# EAGLE design ingress (EAGLE 5.11)

## Sheet 1 of 3
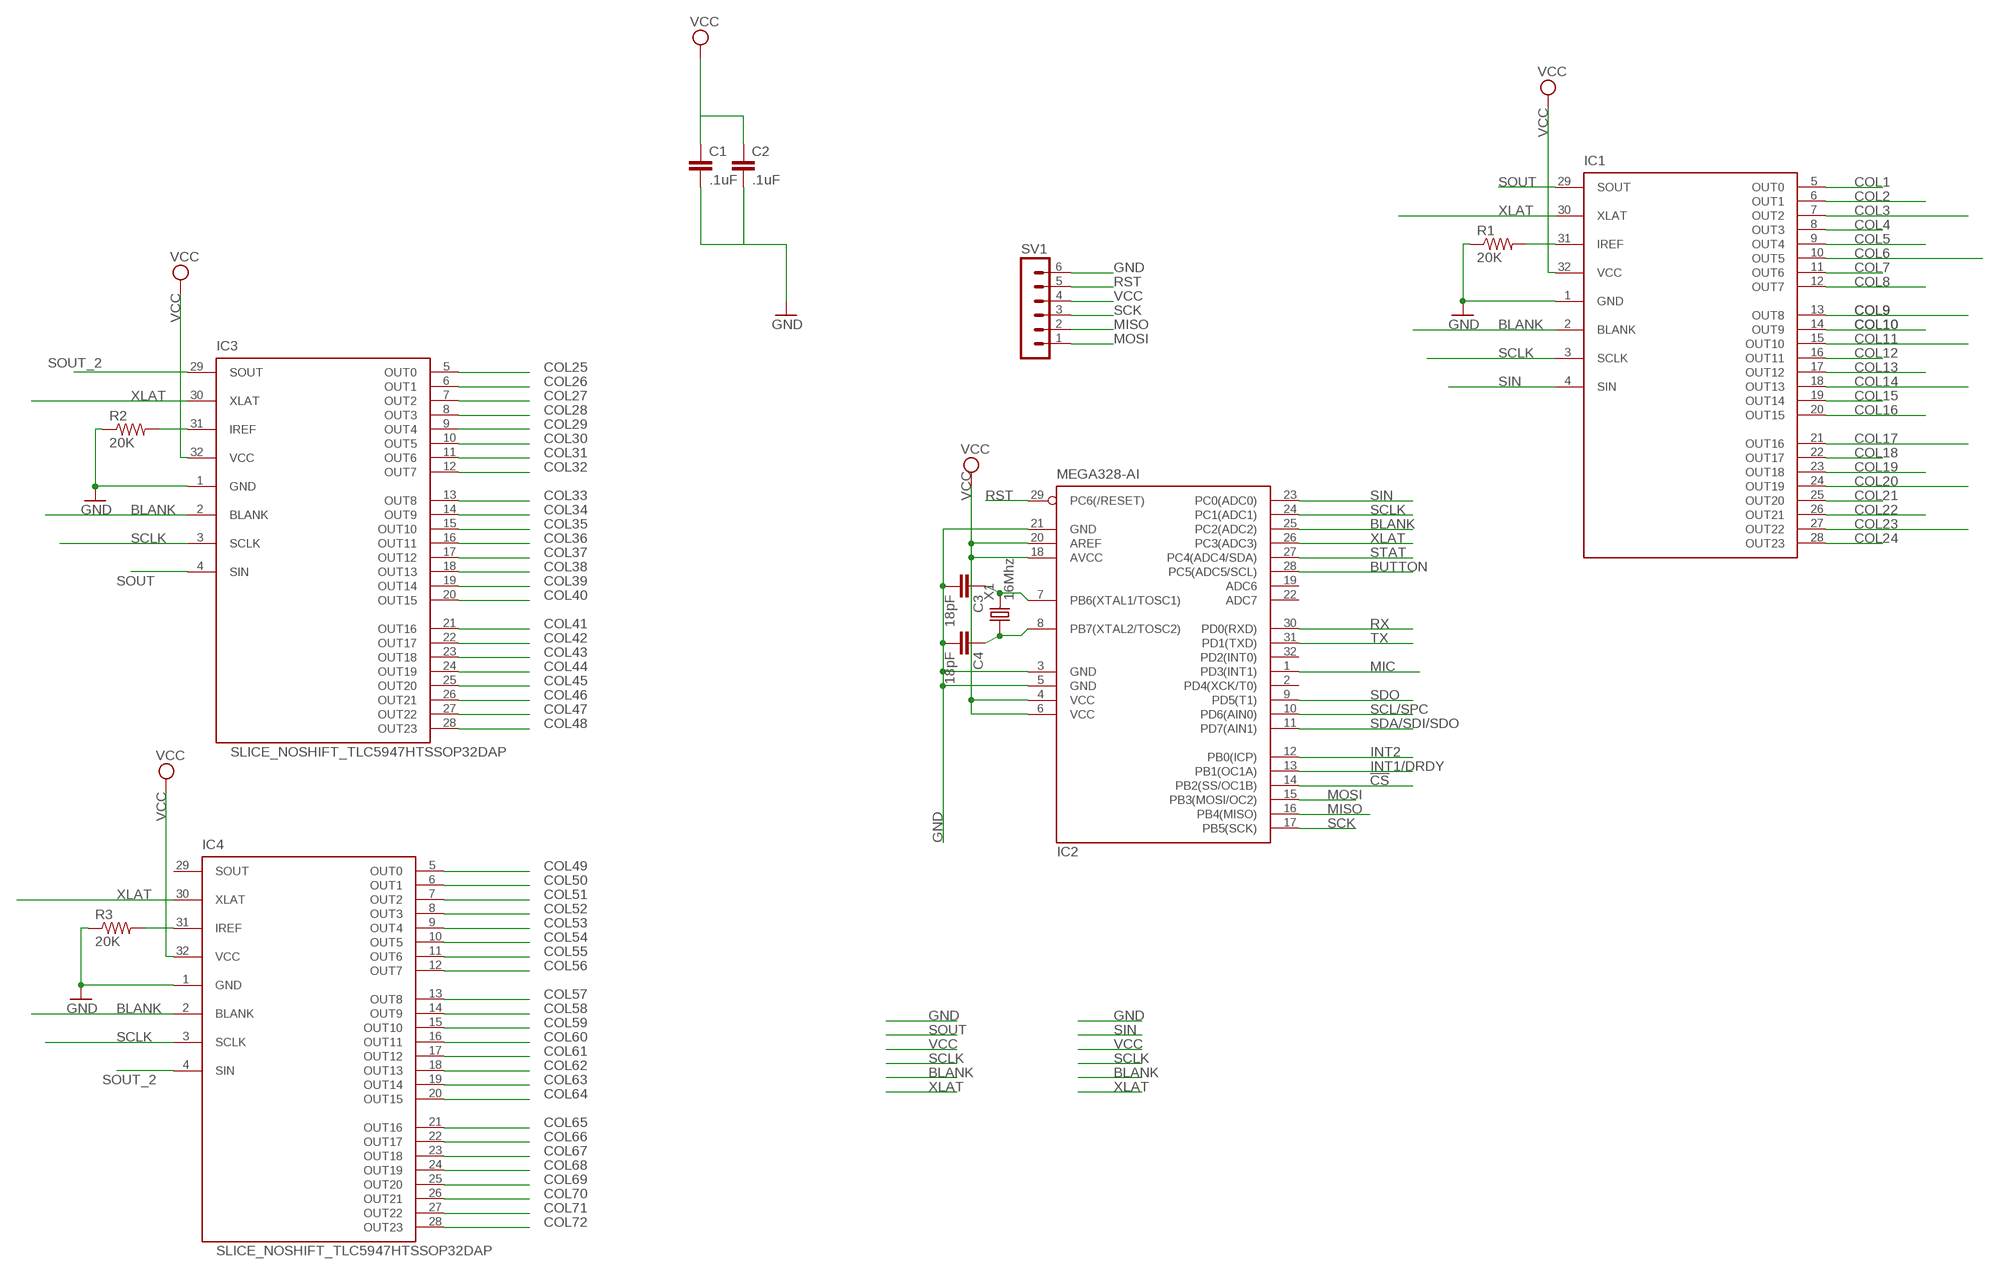
[diagram p0: schematic, sheet 1]

### Parts
C1  .1uF  CAP0805  [0805]
C2  .1uF  CAP0805  [0805]
C3  18pF  CAP0805  [0805]
C4  18pF  CAP0805  [0805]
IC1  SLICE_NOSHIFT_TLC5947HTSSOP32DAP  [HTSSOP32DAP]
IC2  MEGA328-AI  MEGA8-AI  [TQFP32-08]
IC3  SLICE_NOSHIFT_TLC5947HTSSOP32DAP  [HTSSOP32DAP]
IC4  SLICE_NOSHIFT_TLC5947HTSSOP32DAP  [HTSSOP32DAP]
R1  20K  R-US_R0805  [R0805]
R2  20K  R-US_R0805  [R0805]
R3  20K  R-US_R0805  [R0805]
SV1  MA06-1  [MA06-1]
X1  16Mhz  CRYSTAL-5032  [5032]

### Nets
!CS: IC2.14(PB2(SS/OC1B))
BLANK: IC1.2(BLANK) IC2.25(PC2(ADC2)) IC3.2(BLANK) IC4.2(BLANK)
BUTTON: IC2.28(PC5(ADC5/SCL)) ; also sheet 3
COL1: IC1.5(OUT0) ; also sheet 2
COL2: IC1.6(OUT1) ; also sheet 2
COL3: IC1.7(OUT2) ; also sheet 2
COL4: IC1.8(OUT3) ; also sheet 2
COL5: IC1.9(OUT4) ; also sheet 2
COL6: IC1.10(OUT5) ; also sheet 2
COL7: IC1.11(OUT6) ; also sheet 2
COL8: IC1.12(OUT7) ; also sheet 2
COL9: IC1.13(OUT8) ; also sheet 2
COL10: IC1.14(OUT9) ; also sheet 2
COL11: IC1.15(OUT10) ; also sheet 2
COL12: IC1.16(OUT11) ; also sheet 2
COL13: IC1.17(OUT12) ; also sheet 2
COL14: IC1.18(OUT13) ; also sheet 2
COL15: IC1.19(OUT14) ; also sheet 2
COL16: IC1.20(OUT15) ; also sheet 2
COL17: IC1.21(OUT16) ; also sheet 2
COL18: IC1.22(OUT17) ; also sheet 2
COL19: IC1.23(OUT18) ; also sheet 2
COL20: IC1.24(OUT19) ; also sheet 2
COL21: IC1.25(OUT20) ; also sheet 2
COL22: IC1.26(OUT21) ; also sheet 2
COL23: IC1.27(OUT22) ; also sheet 2
COL24: IC1.28(OUT23) ; also sheet 2
COL25: IC3.5(OUT0) ; also sheet 2
COL26: IC3.6(OUT1) ; also sheet 2
COL27: IC3.7(OUT2) ; also sheet 2
COL28: IC3.8(OUT3) ; also sheet 2
COL29: IC3.9(OUT4) ; also sheet 2
COL30: IC3.10(OUT5) ; also sheet 2
COL31: IC3.11(OUT6) ; also sheet 2
COL32: IC3.12(OUT7) ; also sheet 2
COL33: IC3.13(OUT8) ; also sheet 2
COL34: IC3.14(OUT9) ; also sheet 2
COL35: IC3.15(OUT10) ; also sheet 2
COL36: IC3.16(OUT11) ; also sheet 2
COL37: IC3.17(OUT12) ; also sheet 2
COL38: IC3.18(OUT13) ; also sheet 2
COL39: IC3.19(OUT14) ; also sheet 2
COL40: IC3.20(OUT15) ; also sheet 2
COL41: IC3.21(OUT16) ; also sheet 2
COL42: IC3.22(OUT17) ; also sheet 2
COL43: IC3.23(OUT18) ; also sheet 2
COL44: IC3.24(OUT19) ; also sheet 2
COL45: IC3.25(OUT20) ; also sheet 2
COL46: IC3.26(OUT21) ; also sheet 2
COL47: IC3.27(OUT22) ; also sheet 2
COL48: IC3.28(OUT23) ; also sheet 2
COL49: IC4.5(OUT0) ; also sheet 2
COL50: IC4.6(OUT1) ; also sheet 2
COL51: IC4.7(OUT2) ; also sheet 2
COL52: IC4.8(OUT3) ; also sheet 2
COL53: IC4.9(OUT4) ; also sheet 2
COL54: IC4.10(OUT5) ; also sheet 2
COL55: IC4.11(OUT6) ; also sheet 2
COL56: IC4.12(OUT7) ; also sheet 2
COL57: IC4.13(OUT8) ; also sheet 2
COL58: IC4.14(OUT9) ; also sheet 2
COL59: IC4.15(OUT10) ; also sheet 2
COL60: IC4.16(OUT11)
COL61: IC4.17(OUT12)
COL62: IC4.18(OUT13)
COL63: IC4.19(OUT14)
COL64: IC4.20(OUT15)
COL65: IC4.21(OUT16)
COL66: IC4.22(OUT17)
COL67: IC4.23(OUT18)
COL68: IC4.24(OUT19)
COL69: IC4.25(OUT20)
COL70: IC4.26(OUT21)
COL71: IC4.27(OUT22)
COL72: IC4.28(OUT23)
GND: C1.2 C2.2 C3.2 C4.2 IC1.1(GND) IC2.3(GND) IC2.5(GND) IC2.21(GND) IC3.1(GND) IC4.1(GND) R1.1 R2.1 R3.1 SV1.6 ; also sheet 3
INT1/DRDY: IC2.13(PB1(OC1A))
INT2: IC2.12(PB0(ICP))
MIC: IC2.1(PD3(INT1))
MISO: IC2.16(PB4(MISO)) SV1.2
MOSI: IC2.15(PB3(MOSI/OC2)) SV1.1
N$1: IC3.31(IREF) R2.2
N$7: C3.1 IC2.7(PB6(XTAL1/TOSC1)) X1.2
N$8: C4.1 IC2.8(PB7(XTAL2/TOSC2)) X1.1
N$13: IC1.31(IREF) R1.2
N$64: IC4.31(IREF) R3.2
RST: IC2.29(PC6(/RESET)) SV1.5 ; also sheet 3
RX: IC2.30(PD0(RXD))
SCK: IC2.17(PB5(SCK)) SV1.3
SCL/SPC: IC2.10(PD6(AIN0))
SCLK: IC1.3(SCLK) IC2.24(PC1(ADC1)) IC3.3(SCLK) IC4.3(SCLK)
SDA/SDI/SDO: IC2.11(PD7(AIN1))
SDO: IC2.9(PD5(T1))
SIN: IC1.4(SIN) IC2.23(PC0(ADC0))
SOUT: IC1.29(SOUT) IC3.4(SIN)
SOUT_2: IC3.29(SOUT) IC4.4(SIN)
STAT: IC2.27(PC4(ADC4/SDA))
TX: IC2.31(PD1(TXD))
VCC: C1.1 C2.1 IC1.32(VCC) IC2.4(VCC) IC2.6(VCC) IC2.18(AVCC) IC2.20(AREF) IC3.32(VCC) IC4.32(VCC) SV1.4 ; also sheet 2
XLAT: IC1.30(XLAT) IC2.26(PC3(ADC3)) IC3.30(XLAT) IC4.30(XLAT)
Unconnected: IC2.2(PD4(XCK/T0)) IC2.19(ADC6) IC2.22(ADC7) IC2.32(PD2(INT0)) IC4.29(SOUT)

## Sheet 2 of 3
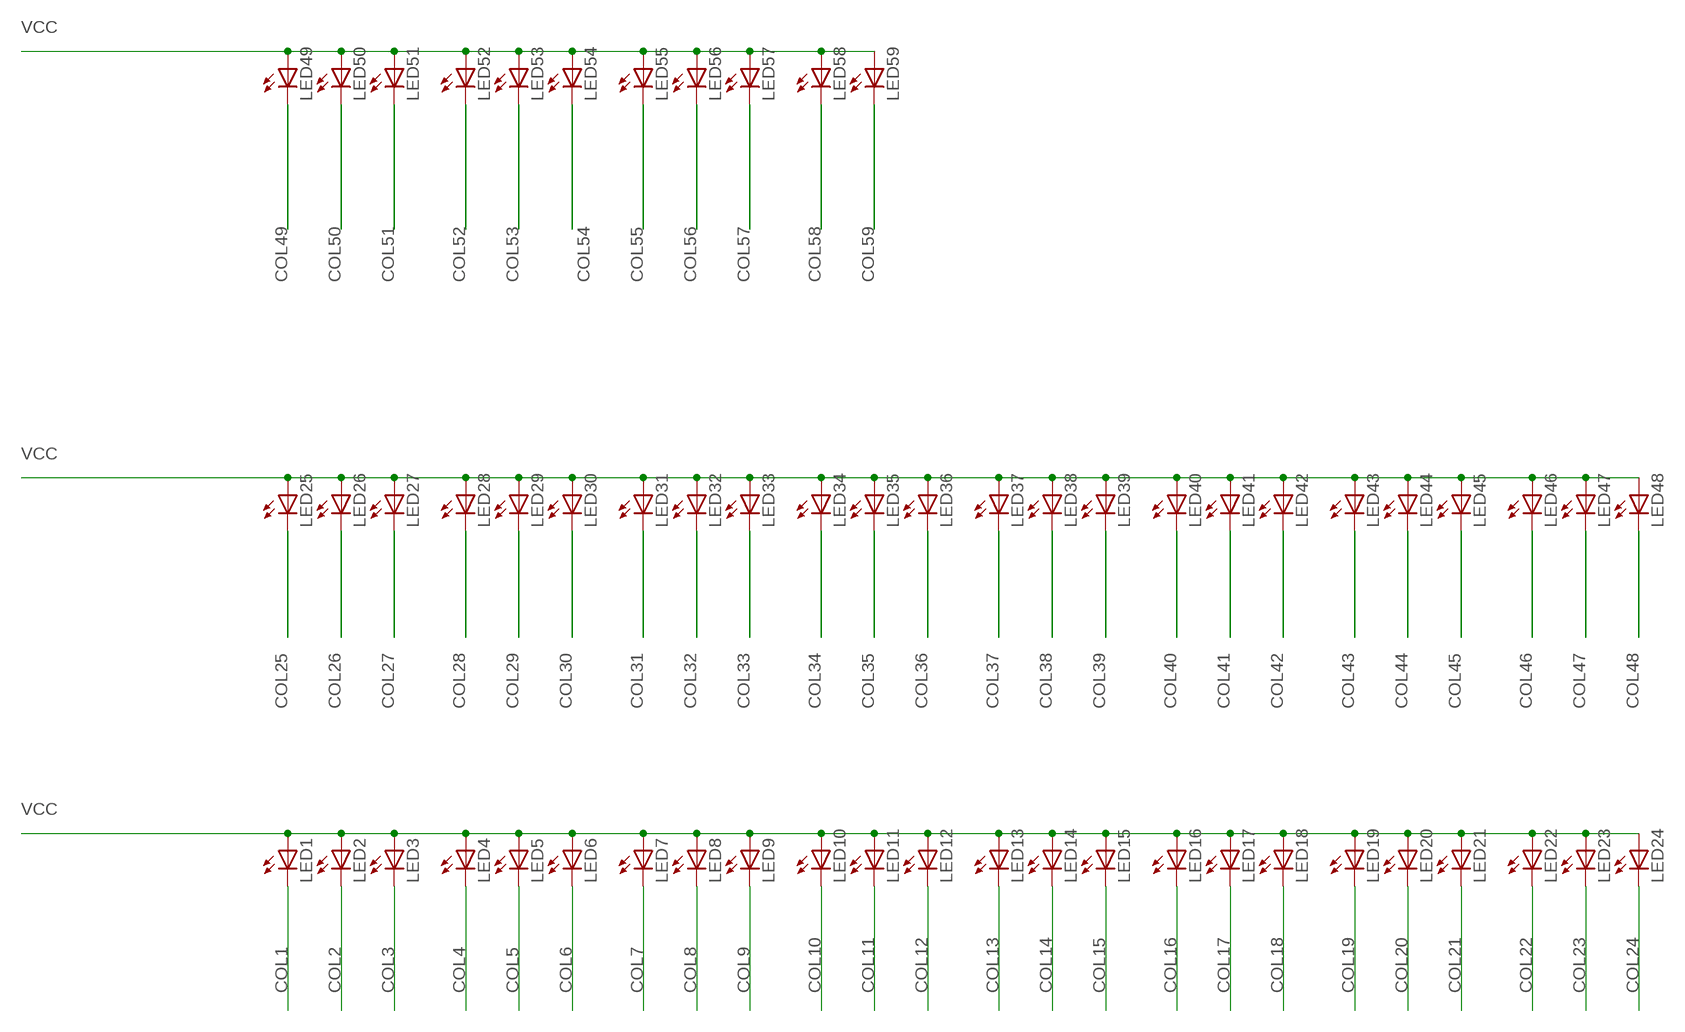
[diagram p1: schematic, sheet 2]

### Parts
LED1  LEDCHIPLED_1206  [CHIPLED_1206]
LED2  LEDCHIPLED_1206  [CHIPLED_1206]
LED3  LEDCHIPLED_1206  [CHIPLED_1206]
LED4  LEDCHIPLED_1206  [CHIPLED_1206]
LED5  LEDCHIPLED_1206  [CHIPLED_1206]
LED6  LEDCHIPLED_1206  [CHIPLED_1206]
LED7  LEDCHIPLED_1206  [CHIPLED_1206]
LED8  LEDCHIPLED_1206  [CHIPLED_1206]
LED9  LEDCHIPLED_1206  [CHIPLED_1206]
LED10  LEDCHIPLED_1206  [CHIPLED_1206]
LED11  LEDCHIPLED_1206  [CHIPLED_1206]
LED12  LEDCHIPLED_1206  [CHIPLED_1206]
LED13  LEDCHIPLED_1206  [CHIPLED_1206]
LED14  LEDCHIPLED_1206  [CHIPLED_1206]
LED15  LEDCHIPLED_1206  [CHIPLED_1206]
LED16  LEDCHIPLED_1206  [CHIPLED_1206]
LED17  LEDCHIPLED_1206  [CHIPLED_1206]
LED18  LEDCHIPLED_1206  [CHIPLED_1206]
LED19  LEDCHIPLED_1206  [CHIPLED_1206]
LED20  LEDCHIPLED_1206  [CHIPLED_1206]
LED21  LEDCHIPLED_1206  [CHIPLED_1206]
LED22  LEDCHIPLED_1206  [CHIPLED_1206]
LED23  LEDCHIPLED_1206  [CHIPLED_1206]
LED24  LEDCHIPLED_1206  [CHIPLED_1206]
LED25  LEDCHIPLED_1206  [CHIPLED_1206]
LED26  LEDCHIPLED_1206  [CHIPLED_1206]
LED27  LEDCHIPLED_1206  [CHIPLED_1206]
LED28  LEDCHIPLED_1206  [CHIPLED_1206]
LED29  LEDCHIPLED_1206  [CHIPLED_1206]
LED30  LEDCHIPLED_1206  [CHIPLED_1206]
LED31  LEDCHIPLED_1206  [CHIPLED_1206]
LED32  LEDCHIPLED_1206  [CHIPLED_1206]
LED33  LEDCHIPLED_1206  [CHIPLED_1206]
LED34  LEDCHIPLED_1206  [CHIPLED_1206]
LED35  LEDCHIPLED_1206  [CHIPLED_1206]
LED36  LEDCHIPLED_1206  [CHIPLED_1206]
LED37  LEDCHIPLED_1206  [CHIPLED_1206]
LED38  LEDCHIPLED_1206  [CHIPLED_1206]
LED39  LEDCHIPLED_1206  [CHIPLED_1206]
LED40  LEDCHIPLED_1206  [CHIPLED_1206]
LED41  LEDCHIPLED_1206  [CHIPLED_1206]
LED42  LEDCHIPLED_1206  [CHIPLED_1206]
LED43  LEDCHIPLED_1206  [CHIPLED_1206]
LED44  LEDCHIPLED_1206  [CHIPLED_1206]
LED45  LEDCHIPLED_1206  [CHIPLED_1206]
LED46  LEDCHIPLED_1206  [CHIPLED_1206]
LED47  LEDCHIPLED_1206  [CHIPLED_1206]
LED48  LEDCHIPLED_1206  [CHIPLED_1206]
LED49  LEDCHIPLED_1206  [CHIPLED_1206]
LED50  LEDCHIPLED_1206  [CHIPLED_1206]
LED51  LEDCHIPLED_1206  [CHIPLED_1206]
LED52  LEDCHIPLED_1206  [CHIPLED_1206]
LED53  LEDCHIPLED_1206  [CHIPLED_1206]
LED54  LEDCHIPLED_1206  [CHIPLED_1206]
LED55  LEDCHIPLED_1206  [CHIPLED_1206]
LED56  LEDCHIPLED_1206  [CHIPLED_1206]
LED57  LEDCHIPLED_1206  [CHIPLED_1206]
LED58  LEDCHIPLED_1206  [CHIPLED_1206]
LED59  LEDCHIPLED_1206  [CHIPLED_1206]

### Nets
COL1: LED1.C ; also sheet 1
COL2: LED2.C ; also sheet 1
COL3: LED3.C ; also sheet 1
COL4: LED4.C ; also sheet 1
COL5: LED5.C ; also sheet 1
COL6: LED6.C ; also sheet 1
COL7: LED7.C ; also sheet 1
COL8: LED8.C ; also sheet 1
COL9: LED9.C ; also sheet 1
COL10: LED10.C ; also sheet 1
COL11: LED11.C ; also sheet 1
COL12: LED12.C ; also sheet 1
COL13: LED13.C ; also sheet 1
COL14: LED14.C ; also sheet 1
COL15: LED15.C ; also sheet 1
COL16: LED16.C ; also sheet 1
COL17: LED17.C ; also sheet 1
COL18: LED18.C ; also sheet 1
COL19: LED19.C ; also sheet 1
COL20: LED20.C ; also sheet 1
COL21: LED21.C ; also sheet 1
COL22: LED22.C ; also sheet 1
COL23: LED23.C ; also sheet 1
COL24: LED24.C ; also sheet 1
COL25: LED25.C ; also sheet 1
COL26: LED26.C ; also sheet 1
COL27: LED27.C ; also sheet 1
COL28: LED28.C ; also sheet 1
COL29: LED29.C ; also sheet 1
COL30: LED30.C ; also sheet 1
COL31: LED31.C ; also sheet 1
COL32: LED32.C ; also sheet 1
COL33: LED33.C ; also sheet 1
COL34: LED34.C ; also sheet 1
COL35: LED35.C ; also sheet 1
COL36: LED36.C ; also sheet 1
COL37: LED37.C ; also sheet 1
COL38: LED38.C ; also sheet 1
COL39: LED39.C ; also sheet 1
COL40: LED40.C ; also sheet 1
COL41: LED41.C ; also sheet 1
COL42: LED42.C ; also sheet 1
COL43: LED43.C ; also sheet 1
COL44: LED44.C ; also sheet 1
COL45: LED45.C ; also sheet 1
COL46: LED46.C ; also sheet 1
COL47: LED47.C ; also sheet 1
COL48: LED48.C ; also sheet 1
COL49: LED49.C ; also sheet 1
COL50: LED50.C ; also sheet 1
COL51: LED51.C ; also sheet 1
COL52: LED52.C ; also sheet 1
COL53: LED53.C ; also sheet 1
COL54: LED54.C ; also sheet 1
COL55: LED55.C ; also sheet 1
COL56: LED56.C ; also sheet 1
COL57: LED57.C ; also sheet 1
COL58: LED58.C ; also sheet 1
COL59: LED59.C ; also sheet 1
VCC: LED1.A LED2.A LED3.A LED4.A LED5.A LED6.A LED7.A LED8.A LED9.A LED10.A LED11.A LED12.A LED13.A LED14.A LED15.A LED16.A LED17.A LED18.A LED19.A LED20.A LED21.A LED22.A LED23.A LED24.A LED25.A LED26.A LED27.A LED28.A LED29.A LED30.A LED31.A LED32.A LED33.A LED34.A LED35.A LED36.A LED37.A LED38.A LED39.A LED40.A LED41.A LED42.A LED43.A LED44.A LED45.A LED46.A LED47.A LED48.A LED49.A LED50.A LED51.A LED52.A LED53.A LED54.A LED55.A LED56.A LED57.A LED58.A LED59.A ; also sheet 1

## Sheet 3 of 3
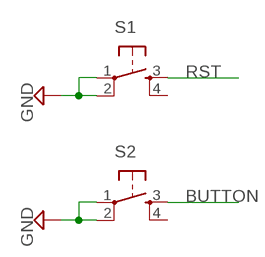
[diagram p2: schematic, sheet 3]

### Parts
S1  TAC_SWITCHSMD  [TACTILE_SWITCH_SMD]
S2  TAC_SWITCHSMD  [TACTILE_SWITCH_SMD]

### Nets
BUTTON: S2.3 ; also sheet 1
GND: S1.1 S1.2 S2.1 S2.2 ; also sheet 1
RST: S1.3 ; also sheet 1
Unconnected: S1.4 S2.4

## Library data of the parts
C1-C4 = slice_noshift:CAP: Capacitor Standard 0603 ceramic capacitor, and 0.1" leaded capacitor.
IC1 IC3 IC4 = 23b_clock_noleds:SLICE_NOSHIFT_TLC5947
IC2 = atmel:MEGA8: MICROCONTROLLER 8 Kbytes FLASH, 1 kbytes SRAM, 512 bytes EEPROM, USART, 6-channel 10 bit ADC, 2-channel 8 bit ADC Pin compatible with Atmega48, ATMega88, ATMega168 Source: avr.lbr; MPN: ATMEGA8-16AU; OC_FARNELL: 9171371; OC_NEWARK: 73M8863
LED1-LED59 = led:LED: LED OSRAM: - CHIPLED LG R971, LG N971, LY N971, LG Q971, LY Q971, LO R971, LY R971 LH N974, LH R974 LS Q976, LO Q976, LY Q976 LO Q996 - Hyper CHIPLED LW Q18S LB Q993, LB Q99A, LB R99A - SideLED LS A670, LO A670, LY A670, LG A670, LP A670 LB A673, LV A673, LT A673, LW A673 LH A674 LY A675 LS A676, LA A676, LO A676, LY A676, LW A676 LS A679, LY A679, LG A679 - Hyper Micro SIDELED® LS Y876, LA Y876, LO Y876, LY Y876 LT Y87S - SmartLED LW L88C, LW L88S LB L89C, LB L89S, LG L890 LS L89K, LO L89K, LY L89K LS L896, LA L896, LO L896, LY L896 - TOPLED LS T670, LO T670, LY T670, LG T670, LP T670 LSG T670, LSP T670, LSY T670, LOP T670, LYG T670 LG T671, LOG T671, LSG T671 LB T673, LV T673, LT T673, LW T673 LH T674 LS T676, LA T676, LO T676, LY T676, LB T676, LH T676, LSB T676, LW T676 LB T67C, LV T67C, LT T67C, LS T67K, LO T67K, LY T67K, LW E67C LS E67B, LA E67B, LO E67B, LY E67B, LB E67C, LV E67C, LT E67C LW T67C LS T679, LY T679, LG T679 LS T770, LO T770, LY T770, LG T770, LP T770 LB T773, LV T773, LT T773, LW T773 LH T774 LS E675, LA E675, LY E675, LS T675 LS T776, LA T776, LO T776, LY T776, LB T776 LHGB T686 LT T68C, LB T68C - Hyper Mini TOPLED® LB M676 - Mini TOPLED Santana® LG M470 LS M47K, LO M47K, LY M47K Source: http://www.osram.convergy.de LUXEON: - LUMILED® LXK2-PW12-R00, LXK2-PW12-S00, LXK2-PW14-U00, LXK2-PW14-V00 LXK2-PM12-R00, LXK2-PM12-S00, LXK2-PM14-U00 LXK2-PE12-Q00, LXK2-PE12-R00, LXK2-PE12-S00, LXK2-PE14-T00, LXK2-PE14-U00 LXK2-PB12-K00, LXK2-PB12-L00, LXK2-PB12-M00, LXK2-PB14-N00, LXK2-PB14-P00, LXK2-PB14-Q00 LXK2-PR12-L00, LXK2-PR12-M00, LXK2-PR14-Q00, LXK2-PR14-R00 LXK2-PD12-Q00, LXK2-PD12-R00, LXK2-PD12-S00 LXK2-PH12-R00, LXK2-PH12-S00 LXK2-PL12-P00, LXK2-PL12-Q00, LXK2-PL12-R00 Source: www.luxeon.com KINGBRIGHT: KA-3528ASYC Source: www.kingbright.com
R1-R3 = rcl:R-US_: RESISTOR, American symbol
S1 S2 = SparkFun:TAC_SWITCH: Momentary Switch Button commonly used for reset or general input. Spark Fun Electronics SKU : COM-00097
SV1 = NSL:MA06-1: PIN HEADER
X1 = NSL_MiniQuad:CRYSTAL*: CRYSTAL

## Net classes
0 default: width 0.254 mm

## Board
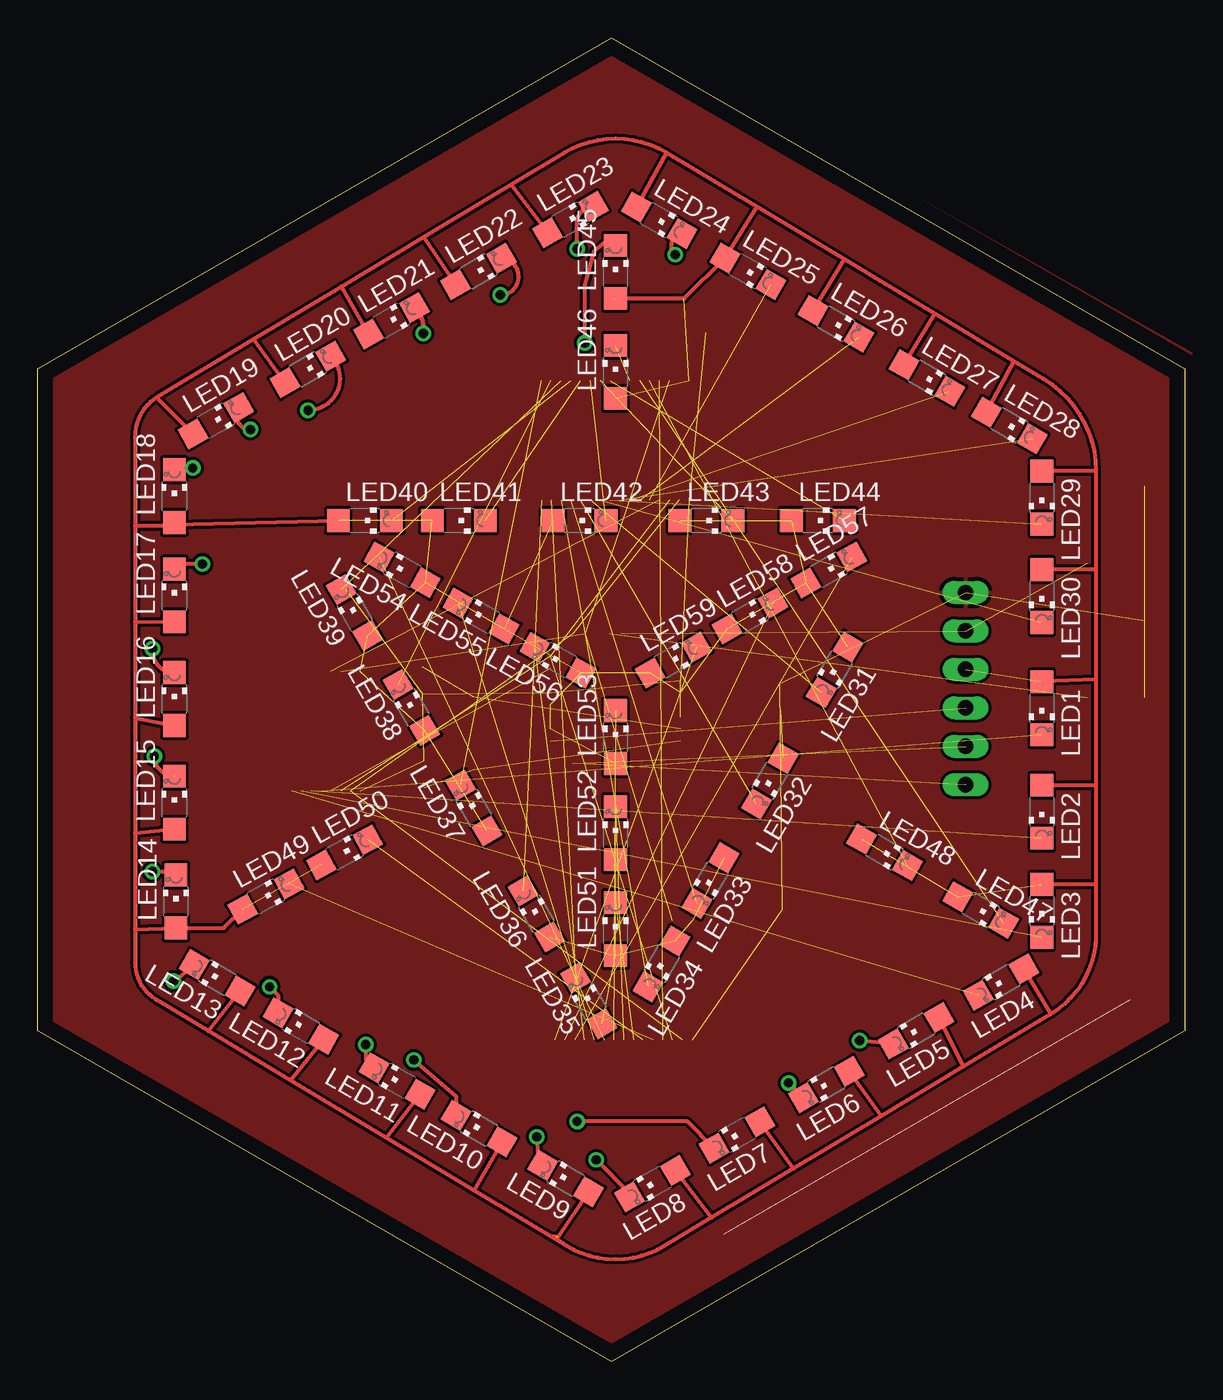
[diagram p3: board, top side]
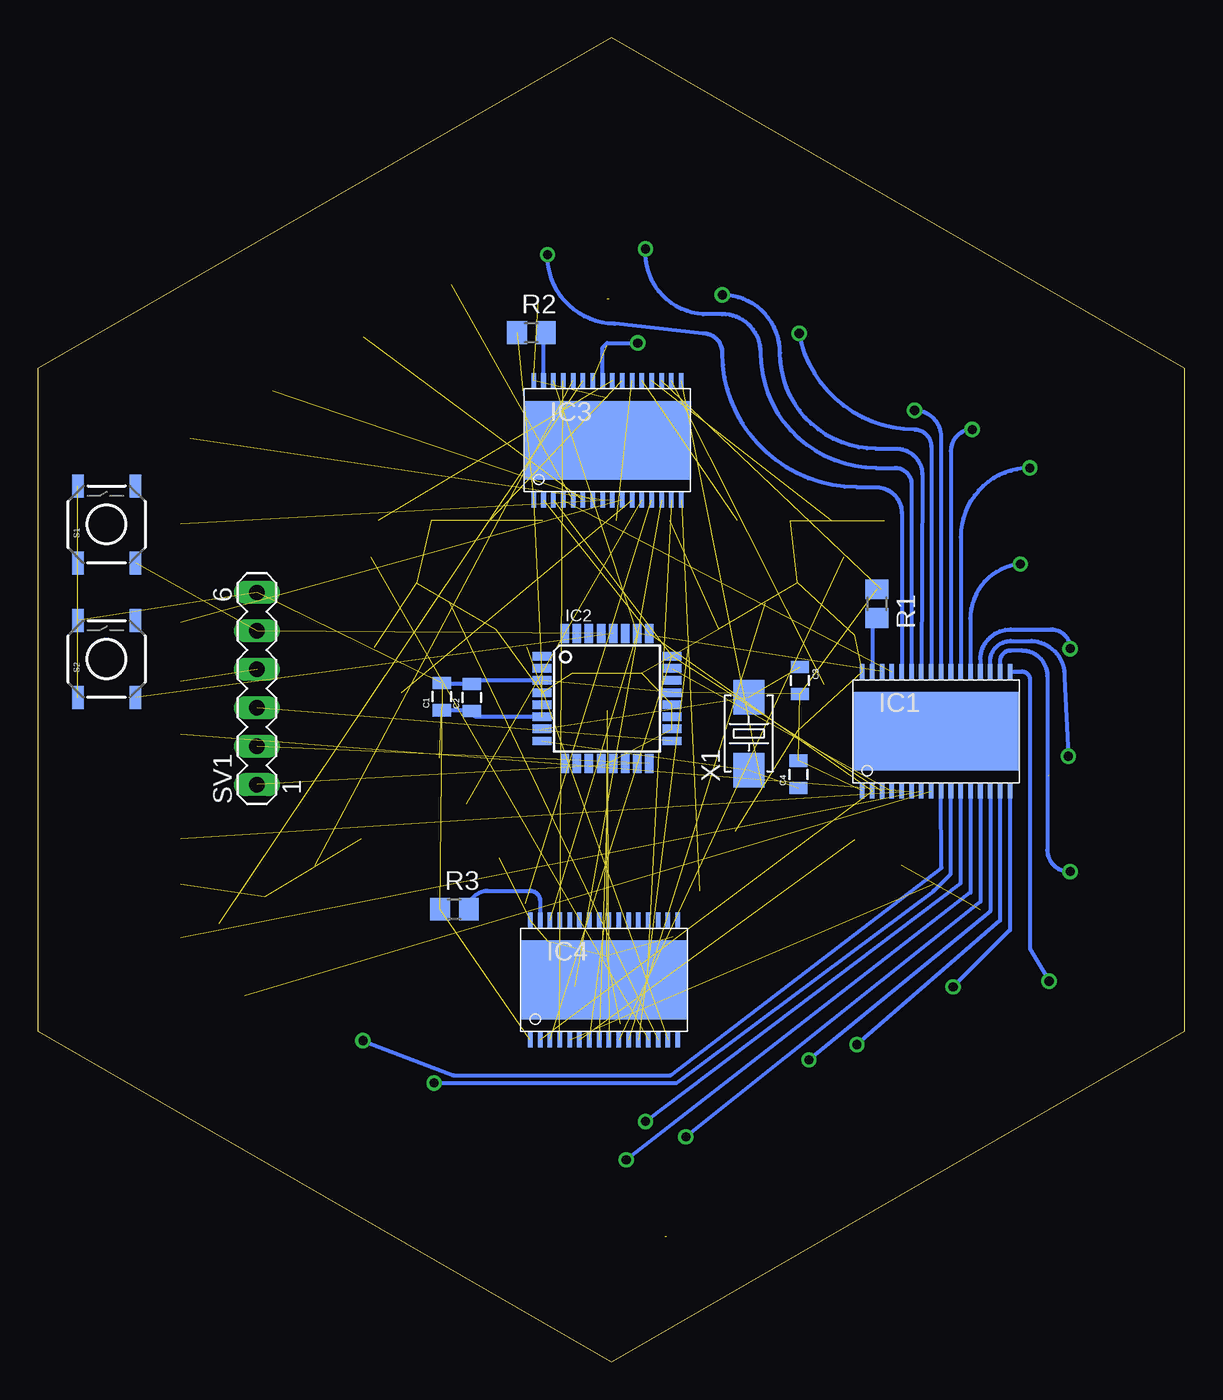
[diagram p4: board, bottom side, seen from below]

Size 75.79 x 87.48 mm. Coordinates in mm from the lower left corner, seen from the top.
Outline: 37.9,0 0,21.87 0,65.61 37.9,87.48 75.79,65.61 75.79,21.87 37.9,0
Copper layers (1*16): Top 0.035mm / dielectric 1.5mm / Bottom 0.035mm
Design rules "default": minimum track width 10mil, minimum drill 24mil, track to track 8mil, track to pad 8mil, pad to pad 8mil, via to via 8mil, smd to smd 8mil, copper to edge 40mil, drill to drill 8mil, minimum pad ring 10mil, minimum via ring 8mil, stop-mask expansion 4mil, vias tented up to drill 0mil, thermal gap 10mil

### Footprints (pad centres in the part's own frame; a part is rotated, then mirrored left to right if it is on the bottom)
0805 = smd 0.8 x 1.2: 1 -0.9,0; 2 0.9,0
HTSSOP32DAP = smd 0.3 x 1: 1 -4.875,-3.95; 2 -4.225,-3.95; 3 -3.575,-3.95; 4 -2.925,-3.95; 5 -2.275,-3.95; 6 -1.625,-3.95; 7 -0.975,-3.95; 8 -0.325,-3.95; 9 0.325,-3.95; 10 0.975,-3.95; 11 1.625,-3.95; 12 2.275,-3.95; 13 2.925,-3.95; 14 3.575,-3.95; 15 4.225,-3.95; 16 4.875,-3.95; 17 4.875,3.95; 18 4.225,3.95; 19 3.575,3.95; 20 2.925,3.95; 21 2.275,3.95; 22 1.625,3.95; 23 0.975,3.95; 24 0.325,3.95; 25 -0.325,3.95; 26 -0.975,3.95; 27 -1.625,3.95; 28 -2.275,3.95; 29 -2.925,3.95; 30 -3.575,3.95; 31 -4.225,3.95; 32 -4.875,3.95 | smd 11 x 5.2: EXP 0,0
TQFP32-08 = smd 1.27 x 0.559: 1 -4.293,2.8; 2 -4.293,2; 3 -4.293,1.2; 4 -4.293,0.4; 5 -4.293,-0.4; 6 -4.293,-1.2; 7 -4.293,-2; 8 -4.293,-2.8; 17 4.293,-2.8; 18 4.293,-2; 19 4.293,-1.2; 20 4.293,-0.4; 21 4.293,0.4; 22 4.293,1.2; 23 4.293,2; 24 4.293,2.8 | smd 0.559 x 1.27: 9 -2.8,-4.293; 10 -2,-4.293; 11 -1.2,-4.293; 12 -0.4,-4.293; 13 0.4,-4.293; 14 1.2,-4.293; 15 2,-4.293; 16 2.8,-4.293; 25 2.8,4.293; 26 2,4.293; 27 1.2,4.293; 28 0.4,4.293; 29 -0.4,4.293; 30 -1.2,4.293; 31 -2,4.293; 32 -2.8,4.293
CHIPLED_1206 = smd 1.5 x 1.5: A 0,-1.75; C 0,1.75
R0805 = smd 1.3 x 1.5: 1 -0.95,0; 2 0.95,0
TACTILE_SWITCH_SMD = smd 1.524 x 0.762: 1 -2.54,1.905; 2 2.54,1.905; 3 -2.54,-1.905; 4 2.54,-1.905
MA06-1 = drill 1.016 long: 1 -6.35,0; 2 -3.81,0; 3 -1.27,0; 4 1.27,0; 5 3.81,0; 6 6.35,0
5032 = smd 2.286 x 2.032: 1 -2.413,0; 2 2.413,0

### Placement (x,y rotation side)
C1  49.1,43.94 90 bottom
C2  47.12,43.89 90 bottom
C3  25.43,45.01 270 bottom
C4  25.53,38.81 90 bottom
IC1  16.43,41.66 0 bottom
IC2  38.18,43.81 0 bottom
IC3  38.15,60.88 0 bottom
IC4  38.38,25.22 0 bottom
LED1  66.34,43.18 180 top
LED2  66.34,36.33 180 top
LED3  66.34,29.78 180 top
LED4  63.65,25.09 120 top
LED5  58.04,21.87 120 top
LED6  52.1,18.32 120 top
LED7  46.2,14.99 120 top
LED8  40.62,11.75 120 top
LED9  34.88,12.1 60 top
LED10  29.15,15.41 60 top
LED11  23.74,18.55 60 top
LED12  17.38,22.18 60 top
LED13  11.85,25.36 60 top
LED14  9.13,30.41 0 top
LED15  9.02,36.94 0 top
LED16  9.02,43.78 0 top
LED17  9.02,50.63 0 top
LED18  9.02,57.2 0 top
LED19  11.77,62.18 300 top
LED20  17.84,65.57 300 top
LED21  23.37,68.79 300 top
LED22  29.11,72.04 300 top
LED23  35.19,75.46 300 top
LED24  41.06,75.43 240 top
LED25  46.92,72.06 240 top
LED26  52.75,68.59 240 top
LED27  58.76,65 240 top
LED28  64.2,61.86 240 top
LED29  66.34,57.1 180 top
LED30  66.34,50.59 180 top
LED31  52.65,45.72 149.5 top
LED32  48.37,38.37 149.5 top
LED33  44.44,31.79 149.5 top
LED34  41.22,26.29 149.5 top
LED35  36.4,23.85 30 top
LED36  32.94,29.59 30 top
LED37  28.81,36.58 30 top
LED38  24.69,43.24 30 top
LED39  20.93,49.5 30 top
LED40  21.61,55.59 270 top
LED41  27.81,55.59 270 top
LED42  35.79,55.59 270 top
LED43  44.19,55.59 270 top
LED44  51.54,55.59 270 top
LED45  38.18,72.01 0 top
LED46  38.18,65.41 0 top
LED47  62.31,29.84 240.1 top
LED48  55.96,33.66 240.1 top
LED49  15.06,30.73 298.6 top
LED50  20.27,33.66 298.6 top
LED51  38.18,28.57 0 top
LED52  38.18,34.92 0 top
LED53  38.18,41.27 0 top
LED54  24.08,52.32 60.9 top
LED55  29.29,49.28 60.9 top
LED56  34.37,46.35 60.9 top
LED57  52.27,52.32 299.4 top
LED58  47.07,49.28 299.4 top
LED59  41.99,46.35 299.4 top
R1  20.35,50.09 270 bottom
R2  43.18,68 0 bottom
R3  48.26,29.9 0 bottom
S1  71.25,55.32 90 bottom
S2  71.25,46.43 90 bottom
SV1  61.32,44.48 90 bottom
X1  28.8,41.5 90 bottom

### Tracks (layer width: path | path; a pad name or v marks a point on that pad's centre or on a via)
BLANK  (3 unrouted)
BUTTON  (1 unrouted)
COL1  (1 unrouted)
COL2  (1 unrouted)
COL3  (1 unrouted)
COL4  (1 unrouted)
COL5  (via drill 0.61)
  Top 0.254: LED5.C v54.31,21.21
  Bottom 0.254: IC1.9 16.08,32.64 33.99,18.92 48.34,18.92 v54.31,21.21
COL6  (via drill 0.61)
  Top 0.254: LED6.C v49.61,18.41
  Bottom 0.254: IC1.10 15.46,32.24 16.59,31.11 33.6,18.41 v49.61,18.41
COL7  (via drill 0.61)
  Top 0.254: v35.64,15.87 42.92,15.87 LED7.C
  Bottom 0.254: IC1.11 14.81,31.62 v35.64,15.87
COL8  (via drill 0.61)
  Top 0.254: v36.91,13.33 39.1,11.14 LED8.C
  Bottom 0.254: IC1.12 14.16,31 v36.91,13.33
COL9  (via drill 0.61)
  Top 0.254: v32.97,14.86 33.1,13.24 LED9.C
  Bottom 0.254: IC1.13 13.51,30.38 v32.97,14.86
COL10  (via drill 0.61)
  Top 0.254: v24.84,19.94 27.64,17.52 LED10.C
  Bottom 0.254: IC1.14 12.86,29.76 v24.84,19.94
COL11  (via drill 0.61)
  Top 0.254: v21.67,20.95 21.67,19.98 LED11.C
  Bottom 0.254: IC1.15 12.21,29.14 v21.67,20.95
COL12  (via drill 0.61)
  Top 0.254: v15.32,24.76 15.87,24.22 LED12.C
  Bottom 0.254: IC1.16 11.56,28.52 v15.32,24.76
COL13  (via drill 0.61)
  Top 0.254: v8.97,25.15 arc11 LED13.C
  Bottom 0.254: IC1.17 10.76,45.61 arc90 10.24,45.09 10.24,27.3 v8.97,25.15
COL14  (via drill 0.61)
  Top 0.254: v7.57,32.38 8.91,32.38 arc-90 LED14.C
  Bottom 0.254: IC1.18 12.21,46.29 arc90 11.51,46.99 10.74,46.99 arc90 9.09,45.34 9.09,33.78 arc-90 v7.57,32.38
COL15  (via drill 0.61)  (1 unrouted)
  Top 0.254: v7.7,40 arc90 8.97,38.73
  Bottom 0.254: IC1.19 12.86,46.27 arc90 11.51,47.62 10.11,47.62 arc90 7.95,45.21 v7.7,40
COL16  (via drill 0.61)
  Top 0.254: v7.57,47.12 7.57,46.98 arc90 LED16.C
  Bottom 0.254: IC1.20 13.51,46.38 arc90 11.51,48.39 8.84,48.39 arc90 v7.57,47.12
COL17  (via drill 0.61)
  Top 0.254: v10.87,52.7 9.35,52.7 arc90 LED17.C
  Bottom 0.254: IC1.21 14.16,48.78 arc90 v10.87,52.7
COL18  (via drill 0.61)
  Top 0.254: v10.24,59.05 9.13,59.05 arc90 LED18.C
  Bottom 0.254: IC1.22 14.81,54.48 arc90 v10.24,59.05
COL19  (via drill 0.61)
  Top 0.254: LED19.C arc125 v14.05,61.59
  Bottom 0.254: IC1.23 15.46,60.18 arc90 v14.05,61.59
COL20  (via drill 0.61)
  Top 0.254: LED20.C arc-134 v17.86,62.86
  Bottom 0.254: IC1.24 16.11,61.12 arc-90 v17.86,62.86
COL21  (via drill 0.61)
  Top 0.254: v25.48,67.94 arc59 LED21.C
  Bottom 0.254: IC1.25 16.76,60.5 arc-90 17.86,61.59 arc80 v25.48,67.94
COL22  (via drill 0.61)
  Top 0.254: v30.56,70.48 arc177 LED22.C
  Bottom 0.254: IC1.26 17.35,58.67 arc-90 19.13,60.33 20.4,60.33 arc90 26.75,66.67 arc-90 v30.56,70.48
COL23  (via drill 0.61)
  Top 0.254: v35.64,73.53 35.64,75.27 arc-90 LED23.C
  Bottom 0.254: IC1.27 18.06,57.99 arc-90 19.13,59.05 20.4,59.05 arc90 28.02,66.67 arc-90 30.56,69.22 31.83,69.22 arc90 v35.64,73.53
COL24  (via drill 0.61)
  Top 0.254: v42.11,73.15 arc-128 LED24.C
  Bottom 0.254: IC1.28 18.71,56.1 arc-90 20.4,57.78 21.67,57.78 arc90 30.56,66.67 arc-90 31.83,67.94 37.67,68.58 arc90 v42.11,73.15
COL25  (1 unrouted)
COL26  (1 unrouted)
COL27  (1 unrouted)
COL28  (1 unrouted)
COL29  (1 unrouted)
COL30  (1 unrouted)
COL31  (1 unrouted)
COL32  (1 unrouted)
COL33  (1 unrouted)
COL34  (1 unrouted)
COL35  (1 unrouted)
COL36  (1 unrouted)
COL37  (1 unrouted)
COL38  (1 unrouted)
COL39  (1 unrouted)
COL40  (1 unrouted)
COL41  (1 unrouted)
COL42  (1 unrouted)
COL43  (1 unrouted)
COL44  (1 unrouted)
COL45  (via drill 0.61)
  Top 0.254: LED45.C 37.51,74.01 36.78,73.41 36.14,71.12 v36.14,67.31
  Bottom 0.254: IC3.25 38.48,67.01 38.18,67.31 v36.14,67.31
COL46  (1 unrouted)
COL47  (1 unrouted)
COL48  (1 unrouted)
COL49  (1 unrouted)
COL50  (1 unrouted)
COL51  (1 unrouted)
COL52  (1 unrouted)
COL53  (1 unrouted)
COL54  (1 unrouted)
COL55  (1 unrouted)
COL56  (1 unrouted)
COL57  (1 unrouted)
COL58  (1 unrouted)
COL59  (1 unrouted)
GND  (15 unrouted)
  Bottom 0.254: C1.2 arc-90 49.05,44.79 C2.2 arc90 46.89,45.02 IC2.3
  pour Top: 38.18,-0.64 0.08,20.95 0.08,66.67 38.18,88.27 76.28,66.67 76.28,22.22
MISO  (1 unrouted)
MOSI  (1 unrouted)
N$1
  Bottom 0.254: IC3.31 42.38,68 R2.2
N$7  (2 unrouted)
N$8  (2 unrouted)
N$13
  Bottom 0.254: IC1.31 20.66,48.82 arc90 R1.2
N$64
  Bottom 0.254: IC4.31 42.6,30.46 arc-90 43.26,31.11 46.09,31.11 arc-90 R3.2
RST  (2 unrouted)
SCK  (1 unrouted)
SCLK  (3 unrouted)
SIN  (1 unrouted)
SOUT  (1 unrouted)
SOUT_2  (1 unrouted)
VCC  (36 unrouted)
  Top 0.254: 49.94,12.77 55.73,16.25 | 61.15,19.5 55.73,16.25 | 66.94,22.97 61.15,19.5 | 69.93,52.34 69.93,45.09 | 69.93,45.09 69.93,38.08 | 41.54,79.9 47.51,76.31 | 53.3,72.84 59.28,69.25 | 59.28,69.25 64.51,66.11 | 14.27,67.57 7.92,63.76 | 14.27,67.57 20.06,71.05 | 20.06,71.05 25.48,74.3 | 25.48,74.3 31.27,77.77 | 31.27,77.77 34.81,79.9 arc-62 41.54,79.9 | 7.92,63.76 arc59 6.43,61.12 6.43,55.24 | 6.43,55.24 6.43,48.89 | 6.43,48.89 6.43,42.54 | 6.43,42.54 6.43,34.92 | 6.43,34.92 6.43,28.57 | 6.43,28.57 6.43,26.37 arc59 7.81,23.94 11.28,21.85 | 11.28,21.85 16.7,18.6 | 16.7,18.6 23.05,14.79 | 23.05,14.79 28.84,11.32 | 28.84,11.32 34.91,7.67 | 34.91,7.67 arc62 41.44,7.67 44.53,9.52 | 8.89,55.32 8.82,55.24 6.43,55.24 | 8.89,55.32 LED18.A | LED19.A 7.92,63.64 7.92,63.76 | LED20.A 14.27,67.57 | 20.06,71.05 LED21.A | 25.48,74.3 LED22.A | 31.27,77.77 LED23.A | 41.54,79.9 LED24.A | 47.51,76.31 LED25.A 42.71,70.23 38.05,70.23 | 53.3,72.84 LED26.A | 59.28,69.25 LED27.A | 64.51,66.11 LED28.A | 69.93,58.85 LED29.A | 64.51,66.11 66.48,64.93 arc-59 69.93,58.85 | 69.93,52.34 LED30.A | 69.93,58.85 69.93,52.34 | 69.93,31.53 LED3.A | 69.93,31.53 69.93,28.25 arc-59 66.94,22.97 | 69.93,38.08 LED2.A | 69.93,38.08 69.93,31.53 | 66.94,22.97 LED4.A | 61.15,19.5 LED5.A | 55.73,16.25 LED6.A | 49.94,12.77 LED7.A | 44.53,9.52 LED8.A | LED9.A 34.37,8.25 | 28.84,11.32 LED10.A | 23.05,14.79 LED11.A | 16.7,18.6 LED12.A | 11.28,21.85 LED13.A | 6.43,28.57 LED14.A 12.29,28.66 LED49.A | 6.43,34.92 LED15.A | 6.43,42.54 LED16.A | 6.43,48.89 LED17.A | 47.51,76.31 53.3,72.84 | 8.89,55.32 LED40.A | 34.91,7.67 34.24,8.13 34.24,8.25 33.99,8.25 | 44.53,9.52 49.94,12.77 | 69.93,45.09 LED1.A
  Bottom 0.254: C1.1 47.17,43.04 arc90 C2.1 arc-90 46.74,42.61 IC2.6
XLAT  (3 unrouted)